# Altium schematic sheet Encoders.SchDoc
size A
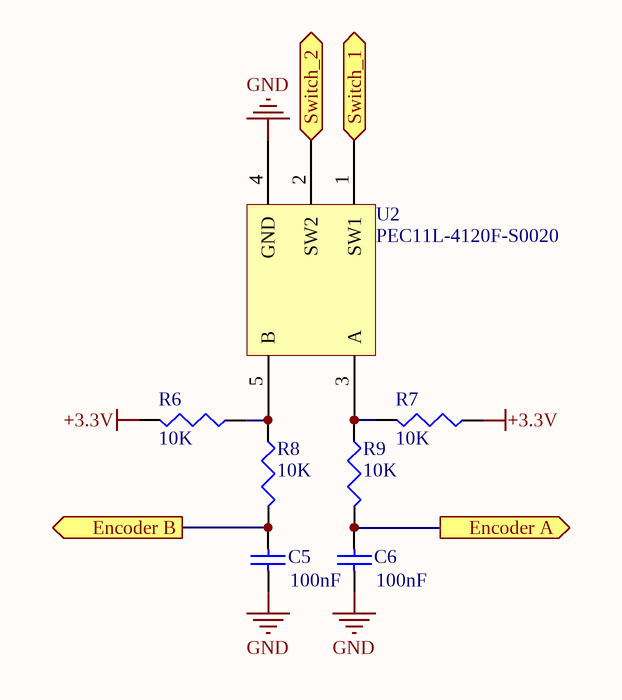
[diagram p0: Encoders.SchDoc]

## Parts
C5  value 100nF  [RES_0603]  (hidden comment: 06035G104ZAT2A)
C6  value 100nF  [RES_0603]  (hidden comment: 06035G104ZAT2A)
R6  value 10K  [RES_0805]  (hidden comment: RR1220P-103-D)
R7  value 10K  [RES_0805]  (hidden comment: RR1220P-103-D)
R8  value 10K  [RES_0805]  (hidden comment: RR1220P-103-D)
R9  value 10K  [RES_0805]  (hidden comment: RR1220P-103-D)
U2  PEC11L-4120F-S0020  [ENC5]

## Ports
Encoder A (out), Encoder B (out), Switch_1, Switch_2

## Nets
+3.3V: R6.2 R7.1
GND: C5.1 C6.1 U2.4(GND)
Encoder A: C6.2 R9.2 ; port Encoder A
Encoder B: C5.2 R8.2 ; port Encoder B
Switch_1: U2.1(SW1) ; port Switch_1
Switch_2: U2.2(SW2) ; port Switch_2
NetR6_1: R6.1 R8.1 U2.5(B)
NetR7_2: R7.2 R9.1 U2.3(A)

## Library data of the parts
C5 C6 = Cap: Capacitor; Manufacturer: AVX Corporation; Manufacturer Part Number: 06035G104ZAT2A; Supplier 1: Digi-Key; Supplier Part Number 1: 478-3724-1-ND
R6-R9 = Res3: Resistor; Manufacturer: Susumu; Manufacturer Part Number: RR1220P-103-D; Supplier 1: Digi-Key; Supplier Part Number 1: RR12P10.0KDCT-ND
U2 = PEC11-4215F-S24: Rotary Encoder with Switch; Manufacturer: Bourns Inc.; Manufacturer Part Number: PEC11L-4120F-S0020; Supplier 1: Digi-Key; Supplier Part Number 1: PEC11L-4120F-S0020-ND